# Altium project ESE516_ExampleLayoutProject_.PrjPcb (part 1 of 2)
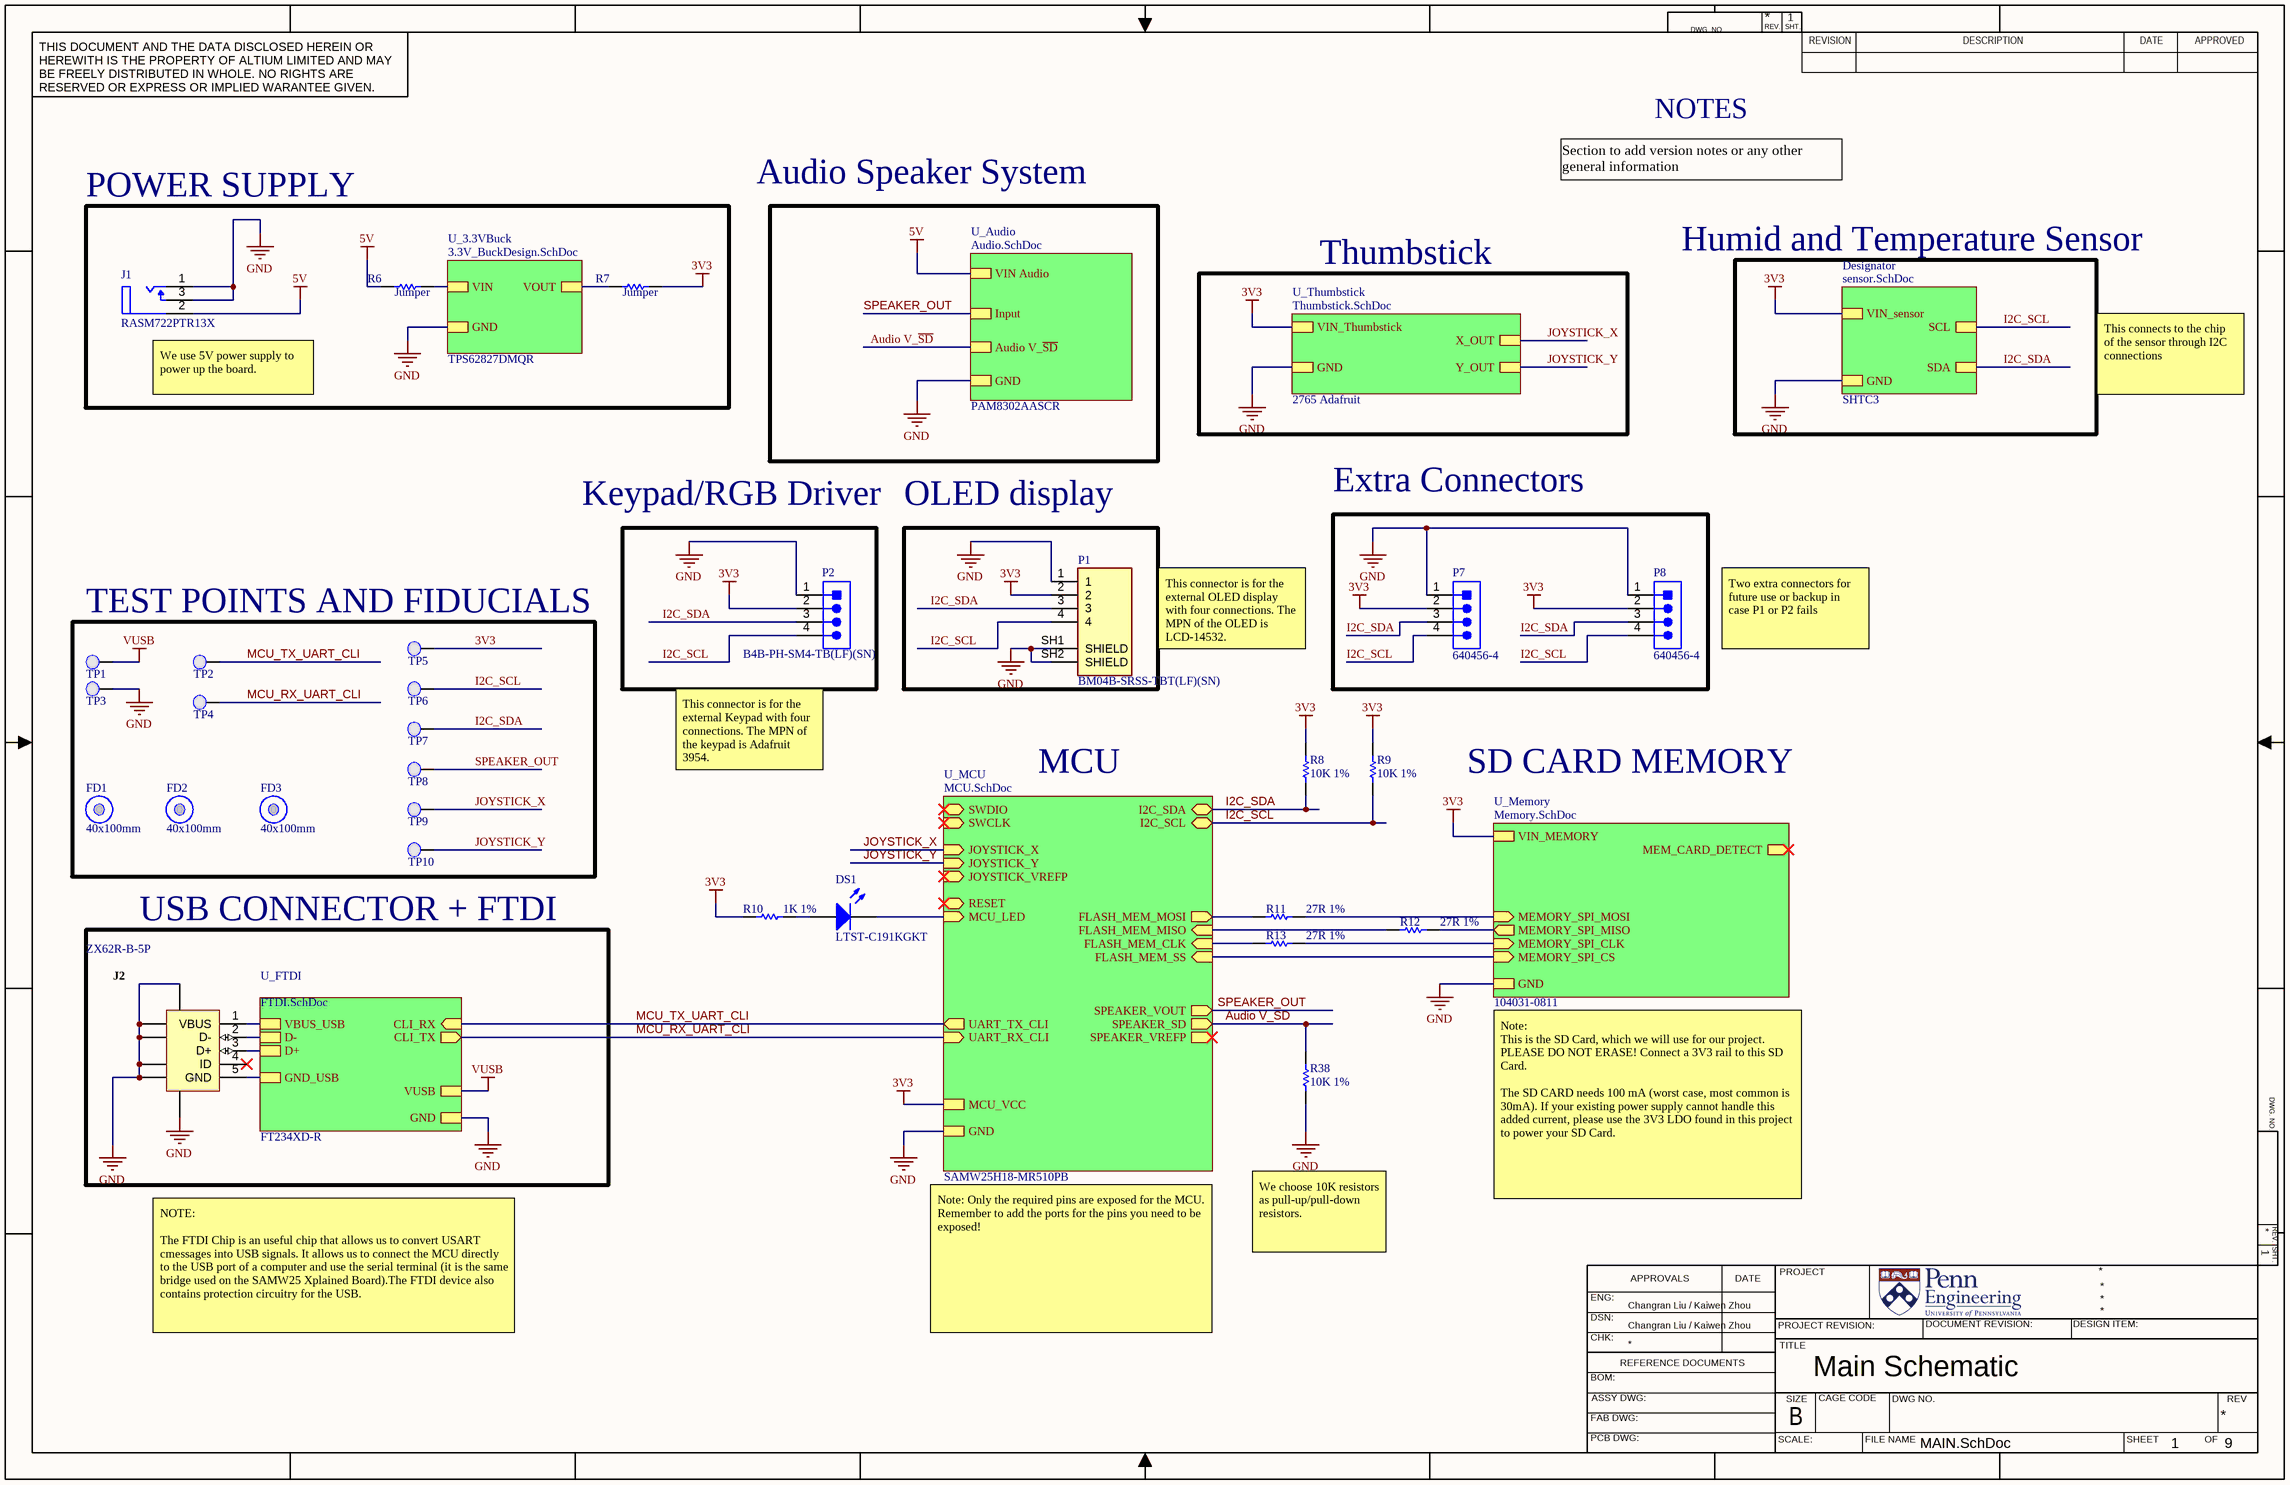
[diagram p0: MAIN.SchDoc]
8 sheets, 114 parts. Net scope: strictly hierarchical (ports join the sheet entries above them; power ports are local).
Board file: ESE516_PCB.PcbDoc
Sheets:
  MAIN.SchDoc
    U_FTDI = FTDI.SchDoc
    U_MCU = MCU.SchDoc
    U_Memory = Memory.SchDoc
    U_3.3VBuck = 3.3V_BuckDesign.SchDoc
    U_Audio = Audio.SchDoc
    U_Thumbstick = Thumbstick.SchDoc
  CommonComponents.SchDoc

## Sheet MAIN.SchDoc: Main Schematic
size 431 x 279 mm; Author: Changran Liu / Kaiwen Zhou; CompanyName: Upenn; DrawnBy: Changran Liu / Kaiwen Zhou; Engineer: Changran Liu / Kaiwen Zhou; Organization: Upenn; DocumentNumber: 1; SheetNumber: 1; SheetTotal: 9

### Parts
DS1  LTST-C191KGKT  [LITE-ON-LTST-C191KRKT-2_V]
FD1  40x100mm  [Fiducial_FT]
FD2  40x100mm  [Fiducial_FT]
FD3  40x100mm  [Fiducial_FT]
J1  RASM722PTR13X  [FP-RASM722PTR13X-MFG]
J2  ZX62R-B-5P  [HIRO-ZX62R-B-5P_V]
P1  BM04B-SRSS-TBT(LF)(SN)  [CONN_BM04B-SRSS-TBT(LF)(SN)]
P2  B4B-PH-SM4-TB(LF)(SN)  [TECO-640456-4]
P7  640456-4  [TECO-640456-4]
P8  640456-4  [TECO-640456-4]
R6  Jumper  [RESC0603(1608)_N]
R7  Jumper  [RESC0603(1608)_N]
R8  10K 1%  [RESC0603(1608)_N]
R9  10K 1%  [RESC0603(1608)_N]
R10  1K 1%  [RESC0603(1608)_N]
R11  27R 1%  [RESC0603(1608)_N]
R12  27R 1%  [RESC0603(1608)_N]
R13  27R 1%  [RESC0603(1608)_N]
R38  10K 1%  [RESC0603(1608)_N]
TP1  0.1" Pad  [PCBComponent]  (value not drawn)
TP2  0.1" Pad  [PCBComponent]  (value not drawn)
TP3  0.1" Pad  [PCBComponent]  (value not drawn)
TP4  0.1" Pad  [PCBComponent]  (value not drawn)
TP5  0.1" Pad  [PCBComponent]  (value not drawn)
TP6  0.1" Pad  [PCBComponent]  (value not drawn)
TP7  0.1" Pad  [PCBComponent]  (value not drawn)
TP8  0.1" Pad  [PCBComponent]  (value not drawn)
TP9  0.1" Pad  [PCBComponent]  (value not drawn)
TP10  0.1" Pad  [PCBComponent]  (value not drawn)

### Blocks framed on the sheet
POWER SUPPLY: J1 R6 R7
OLED display: P1
Extra Connectors: P7 P8
TEST POINTS AND FIDUCIALS: FD1-FD3 TP1-TP10
USB CONNECTOR + FTDI: J2

### Sub-sheets
Designator = sensor.SchDoc (file not in this document): VIN_sensor, SCL, SDA, GND  | MPN: SHTC3
U_3.3VBuck = 3.3V_BuckDesign.SchDoc: VIN, GND, VOUT  | MPN: TPS62827DMQR
U_Audio = Audio.SchDoc: VIN Audio, Input, GND, Audio V_~{SD}  | MPN: PAM8302AASCR
U_FTDI = FTDI.SchDoc: CLI_RX (in), CLI_TX (out), VUSB, GND, VBUS_USB, D-, D+, GND_USB  | MPN: FT234XD-R
U_MCU = MCU.SchDoc: SWDIO (bidir), SWCLK (in), UART_TX_CLI (out), UART_RX_CLI (in), FLASH_MEM_SS (in), FLASH_MEM_CLK (in), FLASH_MEM_MISO (in), FLASH_MEM_MOSI (out), RESET (bidir), MCU_LED (in), MCU_VCC, GND, JOYSTICK_X (in), JOYSTICK_Y (in), JOYSTICK_VREFP (in), I2C_SDA (bidir), I2C_SCL (bidir), SPEAKER_VOUT (out), SPEAKER_VREFP (out), SPEAKER_SD (out)  | MPN: SAMW25H18-MR510PB
U_Memory = Memory.SchDoc: MEMORY_SPI_MOSI (in), MEMORY_SPI_MISO (out), MEMORY_SPI_CLK (in), MEMORY_SPI_CS (in), MEM_CARD_DETECT (out), VIN_MEMORY, GND  | MPN: 104031-0811
U_Thumbstick = Thumbstick.SchDoc: VIN_Thumbstick, GND, X_OUT, Y_OUT  | MPN: 2765 Adafruit

### Nets
3V3: P1.2 P2.2 P7.2 P8.2 R7.2 R8.2 R9.2 R10.1 TP5.1(PAD) ; sheet U_MCU/MCU_VCC, sheet U_Memory/VIN_MEMORY, sheet U_Thumbstick/VIN_Thumbstick, sheet Designator/VIN_sensor
5V: J1.2(SLEEVE_TERMINAL) R6.1 ; sheet U_Audio/VIN Audio
GND: J1.1(TIP_TERMINAL(CENTER_PIN)) J1.3(SHUNT_TERMINAL) J2.5(GND) J2.6(SHLD) J2.7(SHLD) J2.8(SHLD) J2.9(SHLD) J2.10(SHLD) J2.11(SHLD) P1.1 P1.SH1(SHIELD) P1.SH2(SHIELD) P2.1 P7.1 P8.1 R38.1 TP3.1(PAD) ; sheet U_FTDI/GND, sheet U_FTDI/GND_USB, sheet U_MCU/GND, sheet U_Memory/GND, sheet U_3.3VBuck/GND, sheet U_Audio/GND, sheet U_Thumbstick/GND, sheet Designator/GND
VBUS: J2.1(VBUS) ; sheet U_FTDI/VBUS_USB
VIN: R6.2 ; sheet U_3.3VBuck/VIN
VUSB: TP1.1(PAD) ; sheet U_FTDI/VUSB
Audio V_~{SD}: R38.2 ; sheet U_MCU/SPEAKER_SD, sheet U_Audio/Audio V_~{SD}
FLASH_MEM_SPI_SS: sheet U_MCU/FLASH_MEM_SS, sheet U_Memory/MEMORY_SPI_CS
I2C_SCL: P1.4 P2.4 P7.4 P8.4 R9.1 TP6.1(PAD) ; sheet U_MCU/I2C_SCL, sheet Designator/SCL
I2C_SDA: P1.3 P2.3 P7.3 P8.3 R8.1 TP7.1(PAD) ; sheet U_MCU/I2C_SDA, sheet Designator/SDA
JOYSTICK_X: TP9.1(PAD) ; sheet U_MCU/JOYSTICK_X, sheet U_Thumbstick/X_OUT
JOYSTICK_Y: TP10.1(PAD) ; sheet U_MCU/JOYSTICK_Y, sheet U_Thumbstick/Y_OUT
MCU_LED: DS1.2(K) ; sheet U_MCU/MCU_LED
MCU_RX_UART_CLI: TP4.1(PAD) ; sheet U_FTDI/CLI_TX, sheet U_MCU/UART_RX_CLI
MCU_TX_UART_CLI: TP2.1(PAD) ; sheet U_FTDI/CLI_RX, sheet U_MCU/UART_TX_CLI
MEM_SPI_CLK: R13.2 ; sheet U_Memory/MEMORY_SPI_CLK
MEM_SPI_MISO: R12.2 ; sheet U_Memory/MEMORY_SPI_MISO
MEM_SPI_MOSI: R11.2 ; sheet U_Memory/MEMORY_SPI_MOSI
SERCOM1_PAD2_SPI_MISO: R12.1 ; sheet U_MCU/FLASH_MEM_MISO
SERCOM1_PAD2_SPI_MOSI: R11.1 ; sheet U_MCU/FLASH_MEM_MOSI
SERCOM1_PAD3_SPI_SCK: R13.1 ; sheet U_MCU/FLASH_MEM_CLK
SPEAKER_OUT: TP8.1(PAD) ; sheet U_MCU/SPEAKER_VOUT, sheet U_Audio/Input
USB_DATA_N: J2.2(D-) ; sheet U_FTDI/D-
USB_DATA_P: J2.3(D+) ; sheet U_FTDI/D+
VOUT: R7.1 ; sheet U_3.3VBuck/VOUT
NetDS1_1: DS1.1(A) R10.2

Not connected (* = marked no-connect by the designer): J2 4(ID)*

### Notes on the sheet
- NOTES
- Audio Speaker System
- Section to add version notes or any other general information
- Thumbstick
- Humid and Temperature Sensor
- (near J1) We use 5V power supply to power up the board.
- This connects to the chip of the sensor through I2C connections
- Keypad/RGB Driver
- This connector is for the external OLED display with four connections. The MPN of the OLED is LCD-14532.
- Two extra connectors for future use or backup in case P1 or P2 fails
- This connector is for the external Keypad with four connections. The MPN of the keypad is Adafruit 3954.
- MCU
- SD CARD MEMORY
- Note:
  This is the SD Card, which we will use for our project. PLEASE DO NOT ERASE! Connect a 3V3 rail to this SD Card.
  The SD CARD needs 100 mA (worst case, most common is 30mA). If your existing power supply cannot handle this added current, please use the 3V3 LDO found in this project to power your SD Card.
- We choose 10K resistors as pull-up/pull-down resistors.
- NOTE:
  The FTDI Chip is an useful chip that allows us to convert USART cmessages into USB signals. It allows us to connect the MCU directly to the USB port of a computer and use the serial terminal (it is the same bridge used on the SAMW25 Xplained Board).The FTDI device also contains protection circuitry for the USB.
- Note: Only the required pins are exposed for the MCU. Remember to add the ports for the pins you need to be exposed!
- DWG. NO.
- REV.
- SHT.
- THIS DOCUMENT AND THE DATA DISCLOSED HEREIN OR HEREWITH IS THE PROPERTY OF ALTIUM LIMITED AND MAY BE FREELY DISTRIBUTED IN WHOLE. NO RIGHTS ARE RESERVED OR EXPRESS OR IMPLIED WARANTEE GIVEN.
- REVISION
- DESCRIPTION
- DATE
- APPROVED
- ENG:
- APPROVALS
- PROJECT
- DSN:
- CHK:
- REFERENCE DOCUMENTS
- PROJECT REVISION:
- TITLE
- DOCUMENT REVISION:
- DESIGN ITEM:
- BOM:
- FAB DWG:
- PCB DWG:
- ASSY DWG:
- SCALE:
- SIZE
- B
- CAGE CODE
- FILE NAME
- DWG NO.
- SHEET
- OF
- REV

### Library data of the parts
DS1 = CMP-2000-05198-1: Chip LED, Green, 574 nm, 40 pF, -55 to 85 degC, 2-Pin SMD, RoHS, Tape and Reel; Manufacturer: Lite-On; Rad Hardened: No; Emitting Color: YellowGreen; Product Height (mm): 0.55mm; Forward Voltage: 2.4V; Number of Elements: 1; Dominant Wave Length: 571nm; DELETED: Compliant; Viewing Angle: 130deg; High Brightness: Yes; Peak Wavelength: 574nm; Type: Uni-Color; Forward Current: 30mA; Product Length (mm): 1.6mm; Luminous Intensity: 35mcd; Test Current (It): 20mA; Chip Material: AlGaInP; Product Depth (mm): 0.8mm; Shape Type: Rectangular; Reverse Voltage: 5V; Power Dissipation: 75W; Pin Count: 2; Lens Dimensions: 1.1X0.8X0.37mm; Packaging: TapeandReel; Main Category: ChipLED; Operating Temperature Classification: Industrial; Package Type: ChipLed; Mounting: SurfaceMount; Lum Intensity: 35mcd; Operating Temp Range: -55Cto85C; Datasheet Version: Jan-07; Datasheet URL: http://download.siliconexpert.com/pdfs/2007/08/26/semi_b/manual/lot/ds/ltst-c191kgkt.pdf; Manufacturer URL: http://www.us.liteon.com/
FD1-FD3 = CMP-00174-A.4: Fiducial 40x100mm
J1 = CMP-47995-000002-1: CONN PWR JACK 2.1X5.5MM SOLDER; Manufacturer: Switchcraft; Shielding: Unshielded; Gender: Male; Current Rating: 5A; Termination: Solder; Contact Material: Copper Alloy; Package Quantity: 120; Case/Package: SMD/SMT; Contact Plating: Tin; Connector Type: Jack; Housing Material: Thermoplastic; Mount: Surface Mount; Housing Color: Black; Color: Black; Supplier 1: Digi-Key; Supplier Part Number 1: SC2028-1-ND; RoHS: Yes; Category: Power Connectors; Stock 1: 5317; Pricing 1: 1=2.04000, 10=1.95800, 25=1.79520, 50=1.71360 (USD); ComponentLink1URL: https://datasheet.ciiva.com/17/edg4-17820.pdf?src-supplier=Digi-Key; ComponentLink1Description: https://datasheet.ciiva.com/17/edg4-17820.pdf?src-supplier=Digi-Key; ComponentLink2URL: https://datasheet.ciiva.com/18496/edg4-18496955.pdf?src-supplier=Digi-Key; ComponentLink2Description: https://datasheet.ciiva.com/18496/edg4-18496955.pdf?src-supplier=Digi-Key; ComponentLink3URL: https://datasheet.ciiva.com/18496/edg4-18496956.pdf?src-supplier=Digi-Key; ComponentLink3Description: https://datasheet.ciiva.com/18496/edg4-18496956.pdf?src-supplier=Digi-Key; ComponentLink4URL: https://datasheet.ciiva.com/18496/edg4-18496957.pdf?src-supplier=Digi-Key; ComponentLink4Description: https://datasheet.ciiva.com/18496/edg4-18496957.pdf?src-supplier=Digi-Key; Manufacturer Part Number: RASM722PTR13X
J2 = CMP-0031-00001-1: Connector; USBMicro-B,Reverse type, SMT; 5 Position; Right Angle; DatasheetVersion: 08/2010; Operating Temperature: -30 to 85 degC; Mounting Technology: Surface Mount; PartNumber: ZX62R-B-5P; PackageReference: ZX62R-B-5P; ComponentLink2URL: http://www.hirose.co.jp/cataloge_hp/e24200011.pdf; ComponentLink1URL: http://www.hirose.com/â€Ž; ComponentLink2Description: Datasheet; PackageDescription: 5-Pin USB Micro-B R/A Connector; ComponentLink1Description: Manufacturer URL
P1 = BM04B-SRSS-TBT(LF)(SN): Connector Header Surface Mount 4 position 0.039 _1.00mm_; MF: JST Sales; MP: BM04B-SRSS-TBT_LF__SN_; Price: None; Availability: Unavailable; SnapEDA_Link: https://www.snapeda.com/parts/BM04B-SRSS-TBT%28LF%29%28SN%29/JST%20Sales%20America%20Inc./view-part/1647403/?ref=snap; Value: *; Package: None
P2 = B4B-PH-SM4-TB(LF)(SN): Manufacturer: JST; Connector Type: Male Pin; Contact Resistance: 20mR; Current Rating: 2A; Voltage Rating (AC): 100V; Number of Poles: 4; Gender: Male; Insulation Resistance: 1GR; Pitch: 2mm; Supplier 1: Digi-Key; Supplier Part Number 1: 455-1736-1-ND; Manufacturer Part Number: B4B-PH-SM4-TB(LF)(SN); RoHS: Yes; Category: Connectors; Mount: Surface Mount; Housing Material: Polyamide; Contact Plating: Tin,Copper; Contact Material: Copper Alloy,Bronze,Tin,Brass; Color: Natural,White; Housing Color: Beige; Min Operating Temperature: -25°C; Max Operating Temperature: 85°C; Number of Rows: 1; Voltage Rating: 100V; Max Current Rating: 2A; Packaging: Tape and Reel; Number of Positions: 4; Termination: Solder; Fastening Type: Detent; Number of Contacts: 4; Max Voltage Rating (AC): 100V; Working Voltage: 100V; Orientation: Straight; Length: 11.95mm; Width: 5.5mm; Height: 9.4mm; Lead Pitch: 2mm; Contact Mating Length: 0.13inch; Depth: 5mm; Lead Free: Lead Free; Flammability Rating: UL94 V-0; REACH SVHC: No SVHC; ComponentLink1URL: https://datasheet.ciiva.com/8052/1699381-8052048.pdf?src-supplier=Element14; ComponentLink1Description: https://datasheet.ciiva.com/8052/1699381-8052048.pdf?src-supplier=Element14; ComponentLink2URL: https://datasheet.ciiva.com/11747/0900766b80ddea81-11747504.pdf?src-supplier=RSComponents; ComponentLink2Description: https://datasheet.ciiva.com/11747/0900766b80ddea81-11747504.pdf?src-supplier=RSComponents; ComponentLink3URL: https://datasheet.ciiva.com/6747/80567-6747409.pdf?src-supplier=Newark; ComponentLink3Description: https://datasheet.ciiva.com/6747/80567-6747409.pdf?src-supplier=Newark; ComponentLink4URL: https://datasheet.ciiva.com/727/eph-727525.pdf?src-supplier=Digi-Key; ComponentLink4Description: https://datasheet.ciiva.com/727/eph-727525.pdf?src-supplier=Digi-Key; ComponentLink5URL: https://datasheet.ciiva.com/712/eph-712582.pdf?src-supplier=Digi-Key; ComponentLink5Description: https://datasheet.ciiva.com/712/eph-712582.pdf?src-supplier=Digi-Key; ComponentLink6URL: https://datasheet.ciiva.com/712/eph-712583.pdf?src-supplier=Digi-Key; ComponentLink6Description: https://datasheet.ciiva.com/712/eph-712583.pdf?src-supplier=Digi-Key
P7 P8 = CMP-2000-05419-1: Male Header, Pitch 2.54 mm, 1 x 4 Position, Height 10.03 mm, Tail Length 3.56 mm, RoHS, Bulk; Manufacturer: TE Connectivity; Material, Housing: Polyester; Primary Type: InterconnectSystem; Mount Angle: Vertical; Color, Housing: White; Current, Rating: 5 / A; Agency Approvals: CSA,UL; Contact Termination Area Plating: Tin; Temperature, Operating: -55to+105 / degC; Standards: RoHSCompliant,ELVCompliant,UL94V-0; Number of Positions: 4; Brand/Series: MTA-100Series; Angle: Straight; Pin Spacing: 0.1 / "; Material, Contact: CopperAlloy; Connector Type: MTA-100; Special Features: Pinstrip; Mounting Hole Size: 0.04 / "; Contact Centerline Spacing: 0.100 / in.; Voltage, Rating: 250 / V; Manufacturer URL: http://www.te.com/; Length, Pin: 0.14 / "; Length, Overall: 0.4 / "; Color: White; Flammability Rating: UL94V-0; Mounting Type: PCMount; Termination: Solder; Datasheet URL: https://datasheet.ciiva.com/16286/eng-ds-82056-mta-0608-16286228.pdf; Number of Contacts: 4; Contact Shape: Square; Contact Mating Area Plating: Tin; Length, Terminal Post: 0.14 / in.; Size, Post: 0.025 / in.; Contact Plating: Tin; Type: PCBPlug; Datasheet Version: Dec-14; Number of Rows: 1
R6 R7 = CMP-1012-00001-1: Jumper 0603 (1608 Metric); Case-Metric: 1608; Value: 0.00 Ohm; Power: None; Case-EIA: 0603; Technology: SMT; Tolerance: None
R8 R9 R38 = CMP-1012-00623-1: 10K 0.1W 1% 0603 (1608 Metric)  SMD; Value: 10000.00 Ohm; Case-EIA: 0603; Case-Metric: 1608; Power: 0.1 W; Tolerance: 1 %; Technology: SMT
R10 = CMP-1012-00510-1: 1K 0.1W 1% 0603 (1608 Metric)  SMD; Case-Metric: 1608; Case-EIA: 0603; Value: 1000.00 Ohm; Technology: SMT; Tolerance: 1 %; Power: 0.1 W
R11-R13 = CMP-1012-00331-1: 27R 0.1W 1% 0603 (1608 Metric)  SMD; Case-EIA: 0603; Value: 27.00 Ohm; Case-Metric: 1608; Technology: SMT; Tolerance: 1 %; Power: 0.1 W
TP1-TP10 = 0.1" Pad-A.4

## Sheet FTDI.SchDoc: FTDI
size 431 x 279 mm; Author: Changran Liu / Kaiwen Zhou; CompanyName: Upenn; DrawnBy: Changran Liu / Kaiwen Zhou; Engineer: Changran Liu / Kaiwen Zhou; Organization: Upenn; DocumentNumber: 4; SheetNumber: 4; SheetTotal: 9
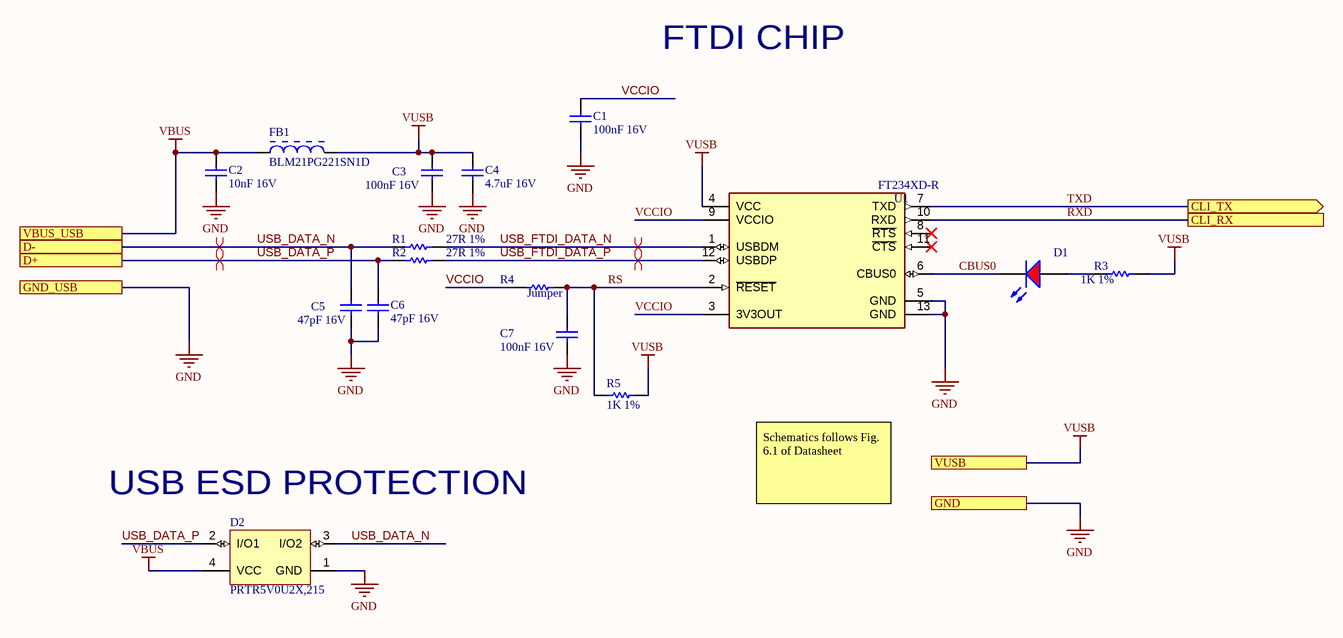
[diagram p1: FTDI.SchDoc]

### Parts
C1  100nF 16V  [CAPC0603(1608)100_N]
C2  10nF 16V  [CAPC0603(1608)100_N]
C3  100nF 16V  [CAPC0603(1608)100_N]
C4  4.7uF 16V  [CAPC0805(2012)145_N]
C5  47pF 16V  [CAPC0603(1608)100_N]
C6  47pF 16V  [CAPC0603(1608)100_N]
C7  100nF 16V  [CAPC0603(1608)100_N]
D1  LTST-C170CKT  [LTST-C170CKT_V]  (value not drawn)
D2  PRTR5V0U2X,215  [NXP-SOT143B-4_V]
FB1  BLM21PG221SN1D  [MURA-BLM21-B20-CHIP-2_V2]
R1  27R 1%  [RESC0603(1608)_N]
R2  27R 1%  [RESC0603(1608)_N]
R3  1K 1%  [RESC0603(1608)_N]
R4  Jumper  [RESC0603(1608)_N]
R5  1K 1%  [RESC0603(1608)_N]
U1  FT234XD-R  [FP-DFN-12-IPC_B]

### Ports
CLI_RX, CLI_TX (out), D+, D-, GND, GND_USB, VBUS_USB, VUSB

### Nets
GND: C1.1 C2.1 C3.1 C4.1 C5.1 C6.1 C7.1 D2.1(GND) U1.5(GND) U1.13(GND) ; port GND, port GND_USB
VBUS: C2.2 D2.4(VCC) FB1.1 ; port VBUS_USB
VUSB: C3.2 C4.2 FB1.2 R3.2 R5.1 U1.4(VCC) ; port VUSB
CBUS0: D1.2(K) U1.6(CBUS0)  [project net CBUS0_4]
RS: C7.2 R4.2 R5.2 U1.2(~{RESET})  [project net RS_4]
RXD: U1.10(RXD) ; port CLI_RX  [project net MCU_TX_UART_CLI]
TXD: U1.7(TXD) ; port CLI_TX  [project net MCU_RX_UART_CLI]
USB_DATA_N: C5.2 D2.3(I/O2) R1.1 ; port D-
USB_DATA_P: C6.2 D2.2(I/O1) R2.1 ; port D+
USB_FTDI_DATA_N: R1.2 U1.1(USBDM)  [project net USB_FTDI_DATA_N_4]
USB_FTDI_DATA_P: R2.2 U1.12(USBDP)  [project net USB_FTDI_DATA_P_4]
VCCIO: C1.2 R4.1 U1.3(3V3OUT) U1.9(VCCIO)  [project net VCCIO_4]
NetD1_1: D1.1(A) R3.1

Not connected (* = marked no-connect by the designer): U1 8(~{RTS})* 11(~{CTS})*

### Layout directives
differential pair: USB_DATA_N, USB_DATA_P, USB_FTDI_DATA_N_4, USB_FTDI_DATA_P_4

### Notes on the sheet
- FTDI CHIP
- (near D2) USB ESD PROTECTION
- Schematics follows Fig. 6.1 of Datasheet
- DWG. NO.
- REV.
- SHT.
- THIS DOCUMENT AND THE DATA DISCLOSED HEREIN OR HEREWITH IS THE PROPERTY OF ALTIUM LIMITED AND MAY BE FREELY DISTRIBUTED IN WHOLE. NO RIGHTS ARE RESERVED OR EXPRESS OR IMPLIED WARANTEE GIVEN.
- REVISION
- DESCRIPTION
- DATE
- APPROVED
- ENG:
- APPROVALS
- PROJECT
- DSN:
- CHK:
- REFERENCE DOCUMENTS
- PROJECT REVISION:
- TITLE
- DOCUMENT REVISION:
- DESIGN ITEM:
- BOM:
- FAB DWG:
- PCB DWG:
- ASSY DWG:
- SCALE:
- SIZE
- B
- CAGE CODE
- FILE NAME
- DWG NO.
- SHEET
- OF
- REV

### Library data of the parts
C1 C3 C7 = CMP-1035-02584-1: CAP 100nF 16V ±10% 0603 (1608 Metric) Thickness 1mm SMD; Tolerance: Â±10%; Case-EIA: 0603; Case-Metric: 1608; Technology: SMT; Max Thickness: 1 mm; Value: 100nF; Rated Voltage: 16 V
C2 = CMP-1035-02311-1: CAP 10nF 16V ±10% 0603 (1608 Metric) Thickness 1mm SMD; Case-EIA: 0603; Case-Metric: 1608; Tolerance: Â±10%; Rated Voltage: 16 V; Value: 10nF; Max Thickness: 1 mm; Technology: SMT
C4 = CMP-1036-04893-1: CAP 4.7uF 16V -20% to +80% 0805 (2012 Metric) Thickness 1.45mm SMD; Case-Metric: 2012; Case-EIA: 0805; Max Thickness: 1.45 mm; Value: 4.7uF; Rated Voltage: 16 V; Tolerance: -20% to +80%; Technology: SMT
C5 C6 = CMP-1035-01048-1: CAP 47pF 16V ±0.5pF 0603 (1608 Metric) Thickness 1mm SMD; Case-EIA: 0603; Case-Metric: 1608; Tolerance: Â±0.5pF; Technology: SMT; Value: 47pF; Rated Voltage: 16 V; Max Thickness: 1 mm
D1 = CMP-1674-00001-5: LED Uni-Color Red, 100 mW, 200 mA, -55 to 85 degC, 2-Pin SMD, RoHS, Tape and Reel; Manufacturer: Lite-On; PackageReference: C170CKT; ComponentLink1Description: Manufacturer URL; ComponentLink1URL: http://www.us.liteon.com/; Package Quantity: 3000; Packaging: Tape and Reel; Pins: 2; ComponentLink2URL: http://media.digikey.com/pdf/Data%20Sheets/Lite-On%20PDFs/LTST-C170CKT.pdf; Max Operating Temperature: 85 degC; Min Operating Temperature: -55 degC; Mounting Technology: Surface Mount; Mount: Surface Mount; Length: 2 mm; ComponentLink2Description: Datasheet; DatasheetVersion: 03/2003; Height: 1.1 mm; PackageDescription: 2-Pin Surface Mount Device, Body 2 x 1.25 mm; RoHSCompliant: true; Colour: Red
D2 = CMP-2000-05285-1: Ultra Low Capacitance Double Rail-to-Rail ESD Protection Diode, 5.5 V, 1 pF, -40 to 85 degC, 4-Pin SOT143B, RoHS, Tape and Reel; Manufacturer: NXP Semiconductors; Capacitance Value: 16pF; Number of Elements: 1; Rad Hardened: No; Reverse Breakdown Voltage: 6V; Working Voltage (Max): 5.5V; Polarity: Uni-Directional; Configuration: Quad; Leakage Current: 0.1uA; Product Height (mm): 1mm; Suppressor Type: DiodeArrays; Product Length (mm): 3mm; Product Depth (mm): 1.4mm; ESD Protection Voltage: 8KV@ContactDisc; Package Type: SOT; Mounting: SurfaceMount; Packaging: TapeandReel; Datasheet Version: Rev. 02, 01/2008; Reverse Stand-off Voltage: 5.5V; Manufacturer URL: http://www.nxp.com/; Operating Temp Range: -40Cto85C; Operating Temperature Classification: Industrial; Working Voltage: 5.5V; Operating Temperature Min Deg. C: -40C; Datasheet URL: https://datasheet.ciiva.com/4479/prtr5v0u2x-102853-4479461.pdf; Leakage Current (Max): 0.1uA; Direction Type: Uni-Directional; Pin Count: 3+Tab; Operating Temperature Max Deg. C: 85C; Mounting Style: SurfaceMount; Package / Case: SOT
FB1 = CMP-0686-00610-2: Chip Ferrite Bead for Power Lines, 220 Ohm, 2000 mA, -55 to 125 degC, 2 x 1.25 x 1.05 mm SMD, Tape and Reel; Manufacturer: Murata; DC Resistance: 0.045 Ohm Max.; Impedance (at 100 MHz): 220 Ohm +/- 25%; Rated Current: 2000 mA; PartNumber: BLM21PG221SN1D; Mounting Technology: Surface Mount; DatasheetVersion: 08/2013; ComponentLink3URL: http://www.murata.com/products/catalog/pdf/c31e.pdf; ComponentLink1URL: http://www.murata.com/; ComponentLink1Description: Manufacturer URL; ComponentLink2URL: http://www.murata.com/products/catalog/pdf/c31e.pdf; PackageDescription: 2-Pin Chip, Body 2 x 1.25 mm; ComponentLink3Description: Package Specification; Operating Temperature Range: -55 to 125 degC; Packing: Tape and Reel; ComponentLink2Description: Datasheet; PackageReference: BLM21_H1050-2
R1 R2 = CMP-1012-00331-1: as R11 on sheet MAIN; Technology: SMT; Tolerance: 1 %; Power: 0.1 W
R3 R5 = CMP-1012-00510-1: as R10 on sheet MAIN; Technology: SMT; Tolerance: 1 %; Power: 0.1 W
R4 = CMP-1012-00001-1: as R6 on sheet MAIN; Technology: SMT; Tolerance: None
U1 = CMP-0248-00027-3: IC USB SERIAL BASIC UART 12DFN; Min Supply Voltage: 2.97V; Number of Ports: 1; Operating Supply Voltage: 5V; Operating Supply Current: 8mA; Max Supply Voltage: 5.5V; Data Rate: 3Mbps; Length: 3mm; Case/Package: DFN; Mount: Surface Mount; Packaging: Tape and Reel; Max Operating Temperature: 85°C; Height: 0.75mm; Number of Pins: 12; Number of Transceivers: 1; Package Quantity: 5000; Min Operating Temperature: -40°C; Width: 3mm; REACH SVHC: No SVHC; Interface: UART; Lead Free: Lead Free

## Sheet MCU.SchDoc: MCU
size 431 x 279 mm; Author: Changran Liu / Kaiwen Zhou; CompanyName: Upenn; DrawnBy: Changran Liu / Kaiwen Zhou; Engineer: Changran Liu / Kaiwen Zhou; Organization: Upenn; DocumentNumber: 3; SheetNumber: 3; SheetTotal: 9
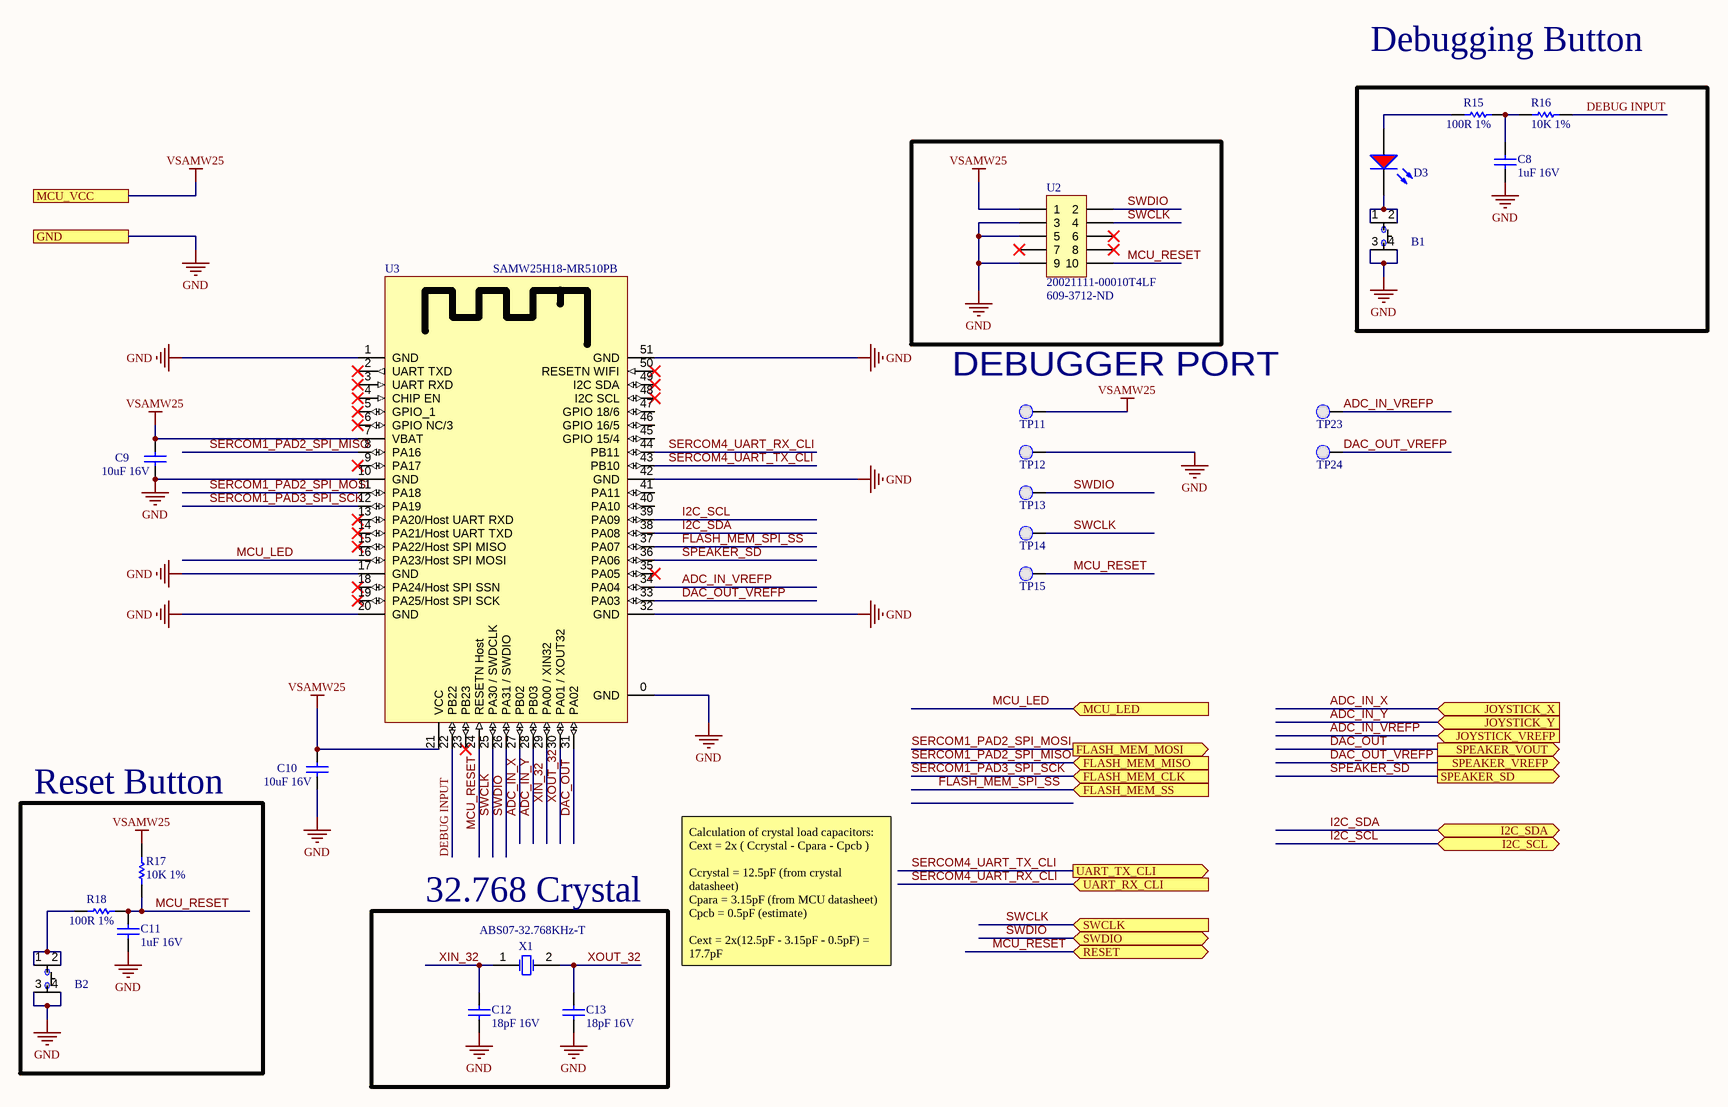
[diagram p2: MCU.SchDoc]

### Parts
B1  PTS810 SJK 250 SMTR LFS  [PTS810 SJK 250 SMTR LFS]  (value not drawn)
B2  PTS810 SJK 250 SMTR LFS  [PTS810 SJK 250 SMTR LFS]  (value not drawn)
C8  1uF 16V  [CAPC0603(1608)100_N]
C9  10uF 16V  [CAPC0805(2012)145_L]
C10  10uF 16V  [CAPC0805(2012)145_L]
C11  1uF 16V  [CAPC0603(1608)100_N]
C12  18pF 16V  [CAPC0603(1608)100_N]
C13  18pF 16V  [CAPC0603(1608)100_N]
D3  LTST-C170CKT  [LTST-C170CKT_V]  (value not drawn)
R15  100R 1%  [RESC0603(1608)_N]
R16  10K 1%  [RESC0603(1608)_N]
R17  10K 1%  [RESC0603(1608)_N]
R18  100R 1%  [RESC0603(1608)_N]
TP11  0.1" Pad  [PCBComponent]  (value not drawn)
TP12  0.1" Pad  [PCBComponent]  (value not drawn)
TP13  0.1" Pad  [PCBComponent]  (value not drawn)
TP14  0.1" Pad  [PCBComponent]  (value not drawn)
TP15  0.1" Pad  [PCBComponent]  (value not drawn)
TP23  0.1" Pad  [PCBComponent]  (value not drawn)
TP24  0.1" Pad  [PCBComponent]  (value not drawn)
U2  20021111-00010T4LF  Supplier Part Number 1: 609-3712-ND  [20021111-00010T4LF]
U3  SAMW25H18-MR510PB  [SAMW25H18-MR510PB]
X1  ABS07-32.768KHz-T  [ABRA-ABS07-2_V]

### Blocks framed on the sheet
Reset Button: B2 C11 R17 R18
32.768 Crystal: C12 C13 X1

### Ports
FLASH_MEM_CLK (in), FLASH_MEM_MISO (in), FLASH_MEM_MOSI (out), FLASH_MEM_SS (in), GND, I2C_SCL (bidir), I2C_SDA (bidir), JOYSTICK_VREFP (in), JOYSTICK_X (in), JOYSTICK_Y (in), MCU_LED (in), MCU_VCC, RESET (bidir), SPEAKER_SD (out), SPEAKER_VOUT (out), SPEAKER_VREFP (out), SWCLK (in), SWDIO (bidir), UART_RX_CLI (in), UART_TX_CLI (out)

### Nets
GND: B1.3 B1.4 B2.3 B2.4 C8.1 C9.1 C10.1 C11.1 C12.1 C13.1 TP12.1(PAD) U2.3 U2.5 U2.9 U3.0(GND) U3.1(GND) U3.10(GND) U3.17(GND) U3.20(GND) U3.32(GND) U3.42(GND) U3.51(GND) ; port GND
VSAMW25: C9.2 C10.2 R17.2 TP11.1(PAD) U2.1 U3.7(VBAT) U3.21(VCC) ; port MCU_VCC  [project net 3V3]
ADC_IN_VREFP: TP23.1(PAD) U3.34(PA04) ; port JOYSTICK_VREFP
ADC_IN_X: U3.27(PB02) ; port JOYSTICK_X  [project net JOYSTICK_X]
ADC_IN_Y: U3.28(PB03) ; port JOYSTICK_Y  [project net JOYSTICK_Y]
DAC_OUT: U3.31(PA02) ; port SPEAKER_VOUT  [project net SPEAKER_OUT]
DAC_OUT_VREFP: TP24.1(PAD) U3.33(PA03) ; port SPEAKER_VREFP
DEBUG INPUT: R16.1 U3.22(PB22)  [project net DEBUG INPUT_3]
FLASH_MEM_SPI_SS: U3.37(PA07) ; port FLASH_MEM_SS
I2C_SCL: U3.39(PA09) ; port I2C_SCL
I2C_SDA: U3.38(PA08) ; port I2C_SDA
MCU_LED: U3.16(PA23/Host_SPI_MOSI) ; port MCU_LED
MCU_RESET: C11.2 R17.1 R18.2 TP15.1(PAD) U2.10 U3.24(RESETN_Host) ; port RESET
SERCOM1_PAD2_SPI_MISO: U3.8(PA16) ; port FLASH_MEM_MISO
SERCOM1_PAD2_SPI_MOSI: U3.11(PA18) ; port FLASH_MEM_MOSI
SERCOM1_PAD3_SPI_SCK: U3.12(PA19) ; port FLASH_MEM_CLK
SERCOM4_UART_RX_CLI: U3.44(PB11) ; port UART_RX_CLI  [project net MCU_RX_UART_CLI]
SERCOM4_UART_TX_CLI: U3.43(PB10) ; port UART_TX_CLI  [project net MCU_TX_UART_CLI]
SPEAKER_SD: U3.36(PA06) ; port SPEAKER_SD  [project net Audio V_~{SD}]
SWCLK: TP14.1(PAD) U2.4 U3.25(PA30_/_SWDCLK) ; port SWCLK
SWDIO: TP13.1(PAD) U2.2 U3.26(PA31_/_SWDIO) ; port SWDIO
XIN_32: C12.2 U3.29(PA00_/_XIN32) X1.1(X1)  [project net XIN_32_3]
XOUT_32: C13.2 U3.30(PA01_/_XOUT32) X1.2(X2)  [project net XOUT_32_3]
NetB1_1: B1.1 B1.2 D3.2(K)
NetB2_1: B2.1 B2.2 R18.1
NetC8_2: C8.2 R15.2 R16.2
NetD3_1: D3.1(A) R15.1

Not connected (* = marked no-connect by the designer): U2 6* 7* 8*; U3 2(UART_TXD)* 3(UART_RXD)* 4(CHIP_EN)* 5(GPIO_1)* 6(GPIO_NC/3)* 9(PA17)* 13(PA20/Host_UART_RXD)* 14(PA21/Host_UART_TXD)* 15(PA22/Host_SPI_MISO)* 18(PA24/Host_SPI_SSN)* 19(PA25/Host_SPI_SCK)* 23(PB23)* 35(PA05)* 40(PA10) 41(PA11) 45(GPIO_15/4) 46(GPIO_16/5) 47(GPIO_18/6) 48(I2C_SCL)* 49(I2C_SDA)* 50(RESETN_WIFI)*

### Notes on the sheet
- Debugging Button
- (near TP11) DEBUGGER PORT
- Calculation of crystal load capacitors:
  Cext = 2x ( Ccrystal - Cpara - Cpcb )
  Ccrystal = 12.5pF (from crystal datasheet)
  Cpara = 3.15pF (from MCU datasheet)
  Cpcb = 0.5pF (estimate)
  Cext = 2x(12.5pF - 3.15pF - 0.5pF) = 17.7pF
- DWG. NO.
- REV.
- SHT.
- THIS DOCUMENT AND THE DATA DISCLOSED HEREIN OR HEREWITH IS THE PROPERTY OF ALTIUM LIMITED AND MAY BE FREELY DISTRIBUTED IN WHOLE. NO RIGHTS ARE RESERVED OR EXPRESS OR IMPLIED WARANTEE GIVEN.
- REVISION
- DESCRIPTION
- DATE
- APPROVED
- ENG:
- APPROVALS
- PROJECT
- DSN:
- CHK:
- REFERENCE DOCUMENTS
- PROJECT REVISION:
- TITLE
- DOCUMENT REVISION:
- DESIGN ITEM:
- BOM:
- FAB DWG:
- PCB DWG:
- ASSY DWG:
- SCALE:
- SIZE
- B
- CAGE CODE
- FILE NAME
- DWG NO.
- SHEET
- OF
- REV

### Library data of the parts
B1 B2 = PTS810 SJK 250 SMTR LFS: SWITCH TACTILE SPST-NO 0.05A 16V Tactile Switch SPST-NO Top Actuated Surface Mount; Manufacturer: ITT /  C&K Components; Part # Aliases: Y97LT25B5DBFP; Operating Force: 2.6 N; Actuator: Oval; Current Rating: 50 mA; Voltage Rating DC: 16 VDC; Contact Form: SPST; Switch Function: OFF - (ON); Mounting Direction: Straight; Stem Height: 2.5 mm; Brand: C&K Components; Travel: 0.15 mm; Manufacturer Part Number: PTS810SJK250SMTRLFS; Product Category: Tactile Switches; RoHS: Details; Termination Style: J Form Lead; Mounting Style: SMD/SMT; Color: White; Packaging: Reel; Contact Plating: Silver; Operating Temperature Range: - 40 C to + 85 C; Series: PTS810; Factory Pack Quantity: 2900; ComponentLink1URL: https://datasheet.ciiva.com/18514/pts810-4mar13-18514061.pdf; ComponentLink1Description: https://datasheet.ciiva.com/18514/pts810-4mar13-18514061.pdf; ComponentLink2URL: https://datasheet.ciiva.com/18514/pts810-4mar13-18514062.pdf; ComponentLink2Description: https://datasheet.ciiva.com/18514/pts810-4mar13-18514062.pdf; ComponentLink3URL: https://datasheet.ciiva.com/18514/pts810-4mar13-18514063.pdf; ComponentLink3Description: https://datasheet.ciiva.com/18514/pts810-4mar13-18514063.pdf; Supplier 1: Digi-Key; Supplier Part Number 1: CKN10503CT-ND
C8 C11 = CMP-1035-02736-1: CAP 1uF 16V ±5% 0603 (1608 Metric) Thickness 1mm SMD; Case-Metric: 1608; Case-EIA: 0603; Tolerance: Â±5%; Technology: SMT; Max Thickness: 1 mm; Rated Voltage: 16 V; Value: 1uF
C9 C10 = CMP-1036-04927-1: CAP 10uF 16V ±10% 0805 (2012 Metric) Thickness 1.45mm SMD; Case-EIA: 0805; Tolerance: Â±10%; Case-Metric: 2012; Rated Voltage: 16 V; Technology: SMT; Value: 10uF; Max Thickness: 1.45 mm
C12 C13 = CMP-1035-00738-1: CAP 18pF 16V ±5% 0603 (1608 Metric) Thickness 1mm SMD; Tolerance: Â±5%; Case-EIA: 0603; Case-Metric: 1608; Max Thickness: 1 mm; Rated Voltage: 16 V; Value: 18pF; Technology: SMT
D3 = CMP-1674-00001-5: as D1 on sheet FTDI; PackageReference: C170CKT; ComponentLink1Description: Manufacturer URL; ComponentLink1URL: http://www.us.liteon.com/; Package Quantity: 3000; Packaging: Tape and Reel; Pins: 2; ComponentLink2URL: http://media.digikey.com/pdf/Data%20Sheets/Lite-On%20PDFs/LTST-C170CKT.pdf; Max Operating Temperature: 85 degC; Min Operating Temperature: -55 degC; Mounting Technology: Surface Mount; Mount: Surface Mount; Length: 2 mm; ComponentLink2Description: Datasheet; DatasheetVersion: 03/2003; Height: 1.1 mm; PackageDescription: 2-Pin Surface Mount Device, Body 2 x 1.25 mm; RoHSCompliant: true; Colour: Red
R15 R18 = CMP-1012-00397-1: 100R 0.1W 1% 0603 (1608 Metric)  SMD; Value: 100.00 Ohm; Case-EIA: 0603; Case-Metric: 1608; Technology: SMT; Tolerance: 1 %; Power: 0.1 W
R16 R17 = CMP-1012-00623-1: as R8 on sheet MAIN; Power: 0.1 W; Tolerance: 1 %; Technology: SMT
TP11-TP15 TP23 TP24 = 0.1" Pad-A.4
U2 = 20021111-00010T4LF: CONN HEADER 10POS UNSHD VERT T/H; Manufacturer: Amphenol / FCI; Stack Height: 2.5 mm; Number of Positions / Contacts: 10; Brand: FCI; Pitch: 1.27 mm; Mounting Angle: Vertical; Current Rating: 10 A; Mating Post Length: 3.05 mm; Voltage Rating: 125 V; Manufacturer Part Number: 20021111-00010T4LF; Mounting Style: Through Hole; Product Category: Headers & Wire Housings; RoHS: Details; Series: Minitek; Product Type: Headers; Type: Unshrouded; Number of Positions: 10; Number of Rows: 2; Contact Plating: Gold; Housing Material: Plastic; Termination Style: Through Hole; Contact Material: Nickel; Packaging: Tube; Factory Pack Quantity: 93; Termination Post Length: 2.3 mm; ComponentLink1URL: https://datasheet.ciiva.com/1433/1079612-1433267.pdf; ComponentLink1Description: https://datasheet.ciiva.com/1433/1079612-1433267.pdf; ComponentLink2URL: https://datasheet.ciiva.com/409/20021111-409158.pdf; ComponentLink2Description: https://datasheet.ciiva.com/409/20021111-409158.pdf; ComponentLink3URL: https://datasheet.ciiva.com/5131/20021111-5131386.pdf; ComponentLink3Description: https://datasheet.ciiva.com/5131/20021111-5131386.pdf; ComponentLink4URL: https://datasheet.ciiva.com/9465/20021111-9465402.pdf; ComponentLink4Description: https://datasheet.ciiva.com/9465/20021111-9465402.pdf; Supplier 1: Digi-Key
U3 = SAMW25H18-MR510PB: RF TXRX MODULE WIFI TRACE ANT; Manufacturer: Atmel; Manufacturer Part Number: ATSAMW25H18-MR510PB; Protocol: 802.11b/g/n; Frequency: 2.4GHz; Data Rate: 65Mbps; Power - Output: 17dBm; Sensitivity: -95.5dBm; Serial Interfaces: SPI, UART; Antenna Type: Integrated, Trace; Memory Size: 256kB Flash, 32kB SRAM; Voltage - Supply: 2.7 V ~ 4.2 V; Category: RF/IF and RFID; Family: RF Transceiver Modules; Series: Xplained Pro; Packaging: Tray; RF Family/Standard: WiFi; Modulation: -; Current - Receiving: -; Current - Transmitting: -; Mounting Type: Surface Mount; Operating Temperature: -40°C ~ 85°C; Package / Case: Module; ComponentLink1URL: http://www.atmel.com/devices/ATSAMW25.aspx; ComponentLink1Description: http://www.atmel.com/devices/ATSAMW25.aspx; ComponentLink2URL: http://www.farnell.com/datasheets/1965115.pdf; ComponentLink2Description: http://www.farnell.com/datasheets/1965115.pdf; Supplier 1: Digikey; Stock 1: 120; Pricing 1: 1=19.14 (USD); Supplier Part Number 1: ATSAMW25H18-MR510PB-ND
X1 = CMP-0447-00001-2: Crystal, 32.768 kHz, 12.5 pF, -40 to 85 degC, SMD Low Profile 3.2 x 1.5 x 0.9 mm, Tape and Reel; Manufacturer: Abracon; Q Value (Type): 30000; Operation Mode: Flexural Mode (Tuning Fork); Shunt Capacitance (C0): 0.9 to 1.2 pF; Load Capacitance (CL): 12.5 pF; Frequency Tolerance @+25degC: +/- 20 ppm; Drive Level (Type): 0.1 uW; Equivalent Series Resistance (R1): 70 Kohm; Insulation Resistance (Min): 500 Mohm; ComponentLink3URL: http://www.abracon.com/Resonators/ABS07.pdf; PackageDescription: 2-Pin Hand Drawn, Body 3.2x1.5mm, Pitch 2.5mm; Operating Temperature: -40 to 85 degC; ComponentLink2URL: http://www.abracon.com/Resonators/ABS07.pdf; PackageReference: ABS07-2; ComponentLink3Description: Package Specification; ComponentLink1Description: Manufacturer URL; DatasheetVersion: 04.03.13; Mounting Technology: Surface Mount; ComponentLink2Description: Datasheet; ComponentLink1URL: http://www.abracon.com/; PartNumber: ABS07-32.768KHz-T; Packing: Tape and Reel; Frequency: 32.768 kHz

## Sheet Memory.SchDoc: Memory
size 431 x 279 mm; Author: Changran Liu / Kaiwen Zhou; CompanyName: Upenn; DrawnBy: Changran Liu / Kaiwen Zhou; Engineer: Changran Liu / Kaiwen Zhou; Organization: Upenn; DocumentNumber: 2; SheetNumber: 2; SheetTotal: 9
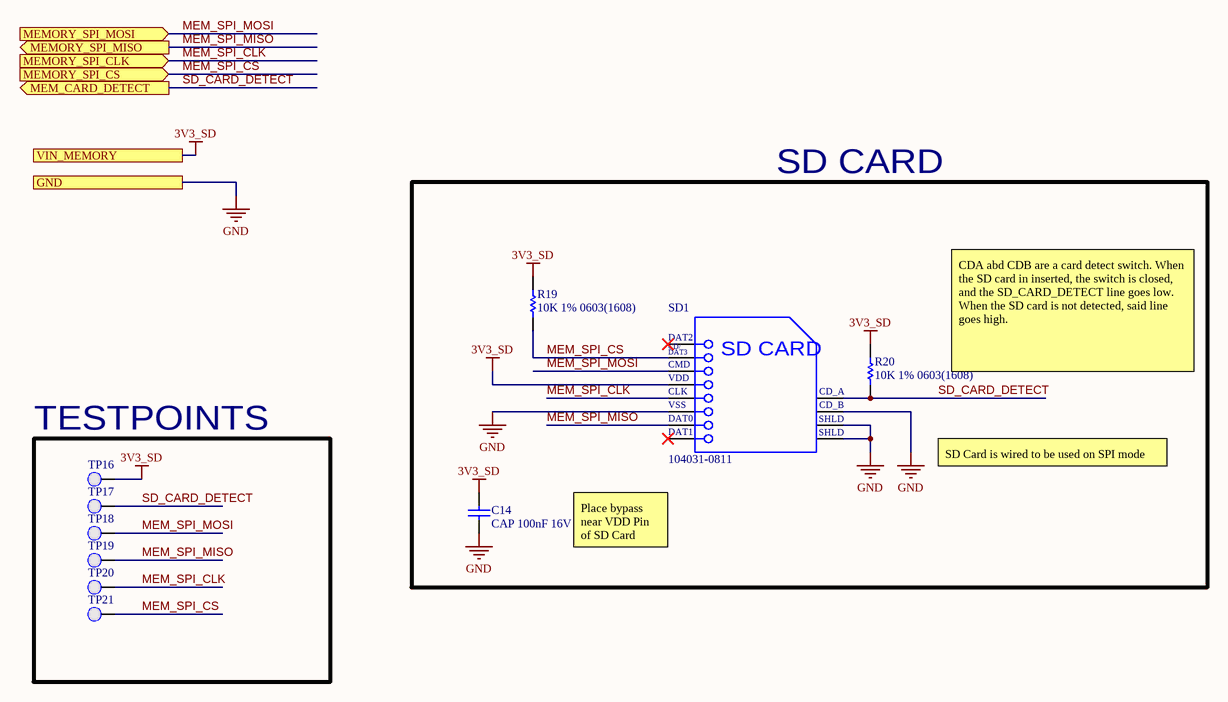
[diagram p3: Memory.SchDoc]

### Parts
C14  CAP 100nF 16V 0603(1608)  [CAPC0603(1608)100_N]
R19  10K 1% 0603(1608)  [RESC0603(1608)_N]
R20  10K 1% 0603(1608)  [RESC0603(1608)_N]
SD1  104031-0811  [MOLX-104031-0811_V]
TP16  0.1" Pad  [PCBComponent]  (value not drawn)
TP17  0.1" Pad  [PCBComponent]  (value not drawn)
TP18  0.1" Pad  [PCBComponent]  (value not drawn)
TP19  0.1" Pad  [PCBComponent]  (value not drawn)
TP20  0.1" Pad  [PCBComponent]  (value not drawn)
TP21  0.1" Pad  [PCBComponent]  (value not drawn)

### Blocks framed on the sheet
SD CARD: C14 R19 R20 SD1
TESTPOINTS: TP16-TP21

### Ports
GND, MEM_CARD_DETECT (out), MEMORY_SPI_CLK (in), MEMORY_SPI_CS (in), MEMORY_SPI_MISO (out), MEMORY_SPI_MOSI (in), VIN_MEMORY

### Nets
3V3_SD: C14.2 R19.2 R20.2 SD1.4(VDD) TP16.1(PAD) ; port VIN_MEMORY  [project net 3V3]
GND: C14.1 SD1.6(VSS2) SD1.10(CD_B) SD1.11(SHLD1) SD1.12(SHLD2) ; port GND
MEM_SPI_CLK: SD1.5(CLK) TP20.1(PAD) ; port MEMORY_SPI_CLK
MEM_SPI_CS: R19.1 SD1.2(CMD) TP21.1(PAD) ; port MEMORY_SPI_CS  [project net FLASH_MEM_SPI_SS]
MEM_SPI_MISO: SD1.7(DAT0) TP19.1(PAD) ; port MEMORY_SPI_MISO
MEM_SPI_MOSI: SD1.3(VSS1) TP18.1(PAD) ; port MEMORY_SPI_MOSI
SD_CARD_DETECT: R20.1 SD1.9(CD_A) TP17.1(PAD) ; port MEM_CARD_DETECT

Not connected (* = marked no-connect by the designer): SD1 1(CD/DAT3)* 8(DAT1)*

### Notes on the sheet
- CDA abd CDB are a card detect switch. When the SD card in inserted, the switch is closed, and the SD_CARD_DETECT line goes low. When the SD card is not detected, said line goes high.
- SD Card is wired to be used on SPI mode
- Place bypass near VDD Pin of SD Card
- DWG. NO.
- REV.
- SHT.
- THIS DOCUMENT AND THE DATA DISCLOSED HEREIN OR HEREWITH IS THE PROPERTY OF ALTIUM LIMITED AND MAY BE FREELY DISTRIBUTED IN WHOLE. NO RIGHTS ARE RESERVED OR EXPRESS OR IMPLIED WARANTEE GIVEN.
- REVISION
- DESCRIPTION
- DATE
- APPROVED
- ENG:
- APPROVALS
- PROJECT
- DSN:
- CHK:
- REFERENCE DOCUMENTS
- PROJECT REVISION:
- TITLE
- DOCUMENT REVISION:
- DESIGN ITEM:
- BOM:
- FAB DWG:
- PCB DWG:
- ASSY DWG:
- SCALE:
- SIZE
- B
- CAGE CODE
- FILE NAME
- DWG NO.
- SHEET
- OF
- REV
- (in symbol CMP-2000-05825-1) DAT2; CD/; DAT3; SD CARD; VSS; SHLD

### Library data of the parts
C14 = CMP-1035-02584-1: as C1 on sheet FTDI; Technology: SMT; Max Thickness: 1 mm; Value: 100nF; Rated Voltage: 16 V
R19 R20 = CMP-1012-00623-1: as R8 on sheet MAIN; Power: 0.1 W; Tolerance: 1 %; Technology: SMT
SD1 = CMP-2000-05825-1: Micro SD Card, RA, -25 to 85 degC, 8-Pin SMD, RoHS, Tape and Reel; Voltage Rating: 10VAC/DC; Number of Contacts: 8; Insertion - Extraction Style: Push-Pull; Pitch: 1.1mm; Mating Cycles: 10000; Brand: Molex; Current Rating: 500mA; Manufacturer URL: http://www.molex.com/; Card Type: microSD; Mounting Type: Standard; Height: 1.42mm; Mounting Technology: SurfaceMount; Contact Plating: Gold; Product Category: MemoryCardConnectors; Package Description: 8-Pin Surface Mount Device, Body 11.95 x 11.4 mm, Pitch 1.1 mm; Datasheet URL: http://www.molex.com/pdm_docs/sd/1040310811_sd.pdf; Termination Style: SMD; Length: 11.4mm; Housing Material: LiquidCrystalPolymer(LCP); Orientation: RightAngle; RoHS: True; Contact Material: PhosphorBronze; Datasheet Version: Rev. E, 04/2006; Packaging: Reel; Manufacturer: Molex; Series: 104031; Product: CardConnectors; Number of Rows: 1Row; Package Reference: 104031-0811
TP16-TP21 = 0.1" Pad-A.4

## Sheet 3.3V_BuckDesign.SchDoc: Buck
size 431 x 279 mm; Author: Changran Liu / Kaiwen Zhou; CompanyName: Upenn; DrawnBy: Changran Liu / Kaiwen Zhou; Engineer: Changran Liu / Kaiwen Zhou; Organization: Upenn; DocumentNumber: 6; SheetNumber: 5; SheetTotal: 9
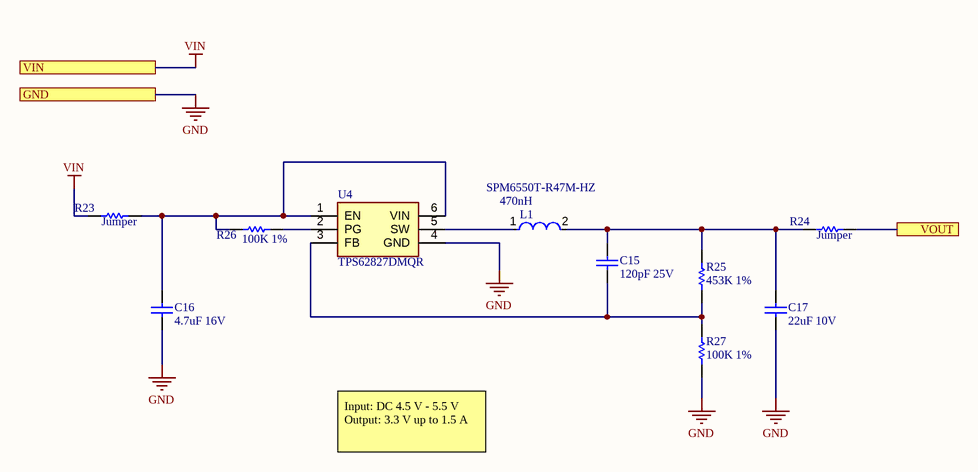
[diagram p4: 3.3V_BuckDesign.SchDoc]

### Parts
C15  120pF 25V  [CAPC0603(1608)100_N]
C16  4.7uF 16V  [CAPC0805(2012)145_N]
C17  22uF 10V  [CAPC0805(2012)100_L]
L1  SPM6550T-R47M-HZ  Inductance: 470nH  [FP-SPM6550-MFG]
R23  Jumper  [RESC0603(1608)_N]
R24  Jumper  [RESC0603(1608)_N]
R25  453K 1%  [RESC0402(1005)_L]
R26  100K 1%  [RESC0603(1608)_N]
R27  100K 1%  [RESC0603(1608)_N]
U4  TPS62827DMQR  [TPS6282518DMQR]

### Ports
GND, VIN, VOUT

### Nets
GND: C16.1 C17.1 R27.1 U4.4(GND) ; port GND
VIN: R23.1 ; port VIN
VOUT: R24.2 ; port VOUT
NetC15_1: C15.1 R25.1 R27.2 U4.3(FB)
NetC15_2: C15.2 C17.2 L1.2 R24.1 R25.2
NetC16_2: C16.2 R23.2 R26.1 U4.1(EN) U4.6(VIN)
NetL1_1: L1.1 U4.5(SW)
NetR26_2: R26.2 U4.2(PG)

### Notes on the sheet
- Input: DC 4.5 V - 5.5 V Output: 3.3 V up to 1.5 A
- DWG. NO.
- REV.
- SHT.
- THIS DOCUMENT AND THE DATA DISCLOSED HEREIN OR HEREWITH IS THE PROPERTY OF ALTIUM LIMITED AND MAY BE FREELY DISTRIBUTED IN WHOLE. NO RIGHTS ARE RESERVED OR EXPRESS OR IMPLIED WARANTEE GIVEN.
- REVISION
- DESCRIPTION
- DATE
- APPROVED
- ENG:
- APPROVALS
- PROJECT
- DSN:
- CHK:
- REFERENCE DOCUMENTS
- PROJECT REVISION:
- TITLE
- DOCUMENT REVISION:
- DESIGN ITEM:
- BOM:
- FAB DWG:
- PCB DWG:
- ASSY DWG:
- SCALE:
- SIZE
- B
- CAGE CODE
- FILE NAME
- DWG NO.
- SHEET
- OF
- REV

### Library data of the parts
C15 = CMP-1035-01312-1: CAP 120pF 25V ±1% 0603 (1608 Metric) Thickness 1mm SMD; Case-Metric: 1608; Case-EIA: 0603; Tolerance: Â±1%; Value: 120pF; Technology: SMT; Max Thickness: 1 mm; Rated Voltage: 25 V
C16 = CMP-1036-04893-1: as C4 on sheet FTDI; Max Thickness: 1.45 mm; Value: 4.7uF; Rated Voltage: 16 V; Tolerance: -20% to +80%; Technology: SMT
C17 = CMP-1036-04944-1: CAP 22uF 10V ±20% 0805 (2012 Metric) Thickness 1mm SMD; Case-Metric: 2012; Case-EIA: 0805; Tolerance: Â±20%; Technology: SMT; Max Thickness: 1 mm; Value: 22uF; Rated Voltage: 10 V
L1 = CMP-08253-000017-1: FIX IND 470NH 26.1A 2.97MOHM SMD; Manufacturer: TDK; Core Material: Metal; Shielding: true; Series Resistance: 2.97mΩ; Test Frequency: 100kHz; Rms Current: 20.5A; Automotive Grade: Grade 1; Tolerance: 20%; Standoff Height: 0.15mm; Lead Free: Yes; Manufacturer Part Number: SPM6550T-R47M-HZ; Automotive: Yes; ComponentLink2URL: https://product.tdk.com/info/en/catalog/datasheets/inductor_automotive_power_spm6550-hz_en.pdf; Temperature Range High: +125°C; Category: Ind; Height: 5mm; Device Class L2: Inductors; Device Class L3: Fixed Inductors; Temperature Range Low: -40°C; RoHS: TRUE; Temperature: -40°C to +125°C; ComponentLink2Description: Datasheet; Device Class L1: Passive Components; Package: SPM6550; Saturation Current: 20.5A; Digikey Description: FIX IND 470NH 26.1A 2.97MOHM SMD; Composition: Wirewound; Octopart: https://octopart.com/spm6550t-r47m-hz-tdk-90326484; Value: 470nH
R23 R24 = CMP-1012-00001-1: as R6 on sheet MAIN; Technology: SMT; Tolerance: None
R25 = CMP-1011-00810-1: 453K 0.063W 1% 0402 (1005 Metric)  SMD; Value: 453000.00 Ohm; Case-Metric: 1005; Case-EIA: 0402; Tolerance: 1 %; Power: 0.063 W; Technology: SMT
R26 R27 = CMP-1012-00736-1: 100K 0.1W 1% 0603 (1608 Metric)  SMD; Value: 100000.00 Ohm; Case-Metric: 1608; Case-EIA: 0603; Power: 0.1 W; Tolerance: 1 %; Technology: SMT
U4 = TPS62827DMQR: 2.4V-5.5V input, 4A step-down converter with 1% Accuracy in 1.5mm x 1.5mm QFN 6-VSON-HR -40 to 125; Manufacturer_Name: Texas Instruments; Datasheet Link: http://www.ti.com/lit/ds/symlink/tps62827.pdf; Height: 1mm; Manufacturer_Part_Number: TPS62827DMQR; Mouser Part Number: 595-TPS62827DMQR; Mouser Price/Stock: https://www.mouser.co.uk/ProductDetail/Texas-Instruments/TPS62827DMQR?qs=byeeYqUIh0P9BITyOJrN9g%3D%3D; Arrow Part Number: TPS62827DMQR; Arrow Price/Stock: https://www.arrow.com/en/products/tps62827dmqr/texas-instruments

## Sheet Audio.SchDoc: Audio
size 431 x 279 mm; Author: Changran Liu / Kaiwen Zhou; CompanyName: Upenn; DrawnBy: Changran Liu / Kaiwen Zhou; Engineer: Changran Liu / Kaiwen Zhou; Organization: Upenn; DocumentNumber: 7; SheetNumber: 6; SheetTotal: 9
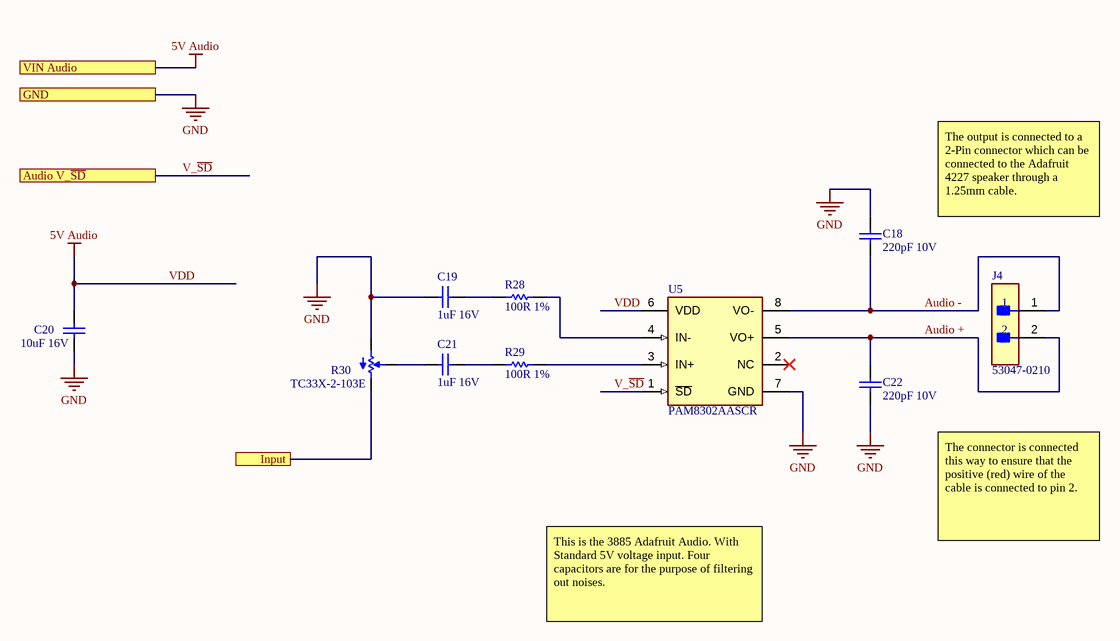
[diagram p5: Audio.SchDoc]

### Parts
C18  220pF 10V  [CAPC0603(1608)100_N]
C19  1uF 16V  [CAPC0603(1608)100_N]
C20  10uF 16V  [CAPC0805(2012)145_L]
C21  1uF 16V  [CAPC0603(1608)100_N]
C22  220pF 10V  [CAPC0603(1608)100_N]
J4  53047-0210  [FP-53047-0210-MFG]
R28  100R 1%  [RESC0603(1608)_M]
R29  100R 1%  [RESC0603(1608)_M]
R30  TC33X-2-103E  [BOUR-TC33X-2_V]
U5  PAM8302AASCR  [FP-MSOP-8-MFG]

### Ports
Audio V_~{SD}, GND, Input, VIN Audio

### Nets
5V Audio: C20.2 U5.6(VDD) ; port VIN Audio  [also labelled VDD]  [project net 5V]
GND: C18.1 C19.2 C20.1 C22.1 R30.3 U5.7(GND) ; port GND
Audio +: C22.2 J4.2 U5.5(VO+)  [project net Audio +_6]
Audio -: C18.2 J4.1 U5.8(VO-)  [project net Audio -_6]
SPEAKER_OUT: R30.1 ; port Input
V_~{SD}: U5.1(~{SD}) ; port Audio V_~{SD}  [project net Audio V_~{SD}]
NetC19_1: C19.1 R28.1
NetC21_1: C21.1 R29.1
NetC21_2: C21.2 R30.2
NetR28_2: R28.2 U5.4(IN-)
NetR29_2: R29.2 U5.3(IN+)

Not connected (* = marked no-connect by the designer): U5 2(NC)*

### Notes on the sheet
- The output is connected to a 2-Pin connector which can be connected to the Adafruit 4227 speaker through a 1.25mm cable.
- The connector is connected this way to ensure that the positive (red) wire of the cable is connected to pin 2.
- This is the 3885 Adafruit Audio. With Standard 5V voltage input. Four capacitors are for the purpose of filtering out noises.
- DWG. NO.
- REV.
- SHT.
- THIS DOCUMENT AND THE DATA DISCLOSED HEREIN OR HEREWITH IS THE PROPERTY OF ALTIUM LIMITED AND MAY BE FREELY DISTRIBUTED IN WHOLE. NO RIGHTS ARE RESERVED OR EXPRESS OR IMPLIED WARANTEE GIVEN.
- REVISION
- DESCRIPTION
- DATE
- APPROVED
- ENG:
- APPROVALS
- PROJECT
- DSN:
- CHK:
- REFERENCE DOCUMENTS
- PROJECT REVISION:
- TITLE
- DOCUMENT REVISION:
- DESIGN ITEM:
- BOM:
- FAB DWG:
- PCB DWG:
- ASSY DWG:
- SCALE:
- SIZE
- B
- CAGE CODE
- FILE NAME
- DWG NO.
- SHEET
- OF
- REV

### Library data of the parts
C18 C22 = CMP-1035-01455-1: CAP 220pF 10V ±2% 0603 (1608 Metric) Thickness 1mm SMD; Tolerance: Â±2%; Case-EIA: 0603; Case-Metric: 1608; Max Thickness: 1 mm; Technology: SMT; Value: 220pF; Rated Voltage: 10 V
C19 C21 = CMP-1035-02736-1: as C8 on sheet MCU; Technology: SMT; Max Thickness: 1 mm; Rated Voltage: 16 V; Value: 1uF
C20 = CMP-1036-04927-1: as C9 on sheet MCU; Rated Voltage: 16 V; Technology: SMT; Value: 10uF; Max Thickness: 1.45 mm
J4 = CMP-2000-05628-3: CONN HEADER VERT 2POS 1.25MM; Manufacturer: Molex; Conn Gender: Male; Voltage Rating: 125V; Conn Orientation: Vertical; Number Of Contacts: 2; Current Rating: 1A; Contact Material: Tin; Temperature Range Low: -40°C; ComponentLink2URL: http://www.molex.com/webdocs/datasheets/pdf/en-us/0530470210_PCB_HEADERS.pdf; Mouser Description: 1.25mm Pitch PicoBlade™ Wire-to-Board Header, Vertical, with Friction Lock, 2 Circuits; Manufacturer Part Number: 53047-0210; Temperature Range High: +85°C; ComponentLink2Description: Datasheet; Automotive: No; RoHS: TRUE; Ambient Temperature Range High: +85°C; Octopart: https://octopart.com/53047-0210-molex-276772; Footprint Url: https://www.molex.com/pdm_docs/sd/530470210_sd.pdf; Lead Free: Yes; Pitch: 1.25mm; Temperature: -40°C to +85°C; Device Class L2: Headers and Wire Housings; Package: 0; Ambient Temperature Range Low: -40°C; Digikey Description: CONN HEADER VERT 2POS 1.25MM; Category: Conn; Device Class L3: unset; Number Of Rows: 1; Device Class L1: Connectors; Height: 4.4mm
R28 R29 = CMP-1012-00397-1: as R15 on sheet MCU; Technology: SMT; Tolerance: 1 %; Power: 0.1 W
R30 = CMP-2100-03695-1: Trimming Potentiometer, 10000 Ohm, -40 to 100 degC, 3-Pin SMD, RoHS, Tape and Reel; Manufacturer: Bourns; Tolerance: 25%; Max Power Dissipation: 100mW; Number of Turns: 1; Resistance: 10KOhm; Temperature Coefficient: 250ppm/degreesC; Voltage Rating (DC): 50V; Datasheet URL: http://www.bourns.com/docs/Product-Datasheets/TC33.pdf; Composition: Potentiometer; Package Description: 3-Pin Surface Mount Device, Body 3.8 x 3.6 mm; Weight: 29.4mg; Power Rating: 100mW; Termination: FootPrint; Manufacturer URL: http://www.bourns.com/; Width: 0.118inch; Height: 0.047inch; Military Standard: Not; Radiation Hardening: No; Colour: Silver; Case/Package: SMD/SMT; Depth: 3.8mm; Min Operating Temperature: -40degC; Lead Free: LeadFree; Datasheet Version: 42583.0; REACH SVHC: NoSVHC; Length: 3mm; RoHSCompliant: true; Contact Plating: Silver; Taper: Linear; Packaging: TapeandReel; Mount: SurfaceMount; Max Operating Temperature: 100degC; Package Reference: TC33X-2; Package Quantity: 2500
U5 = CMP-12733-000002-1: IC AMP CLASS D MONO 2.5W 8MSOP; Manufacturer: Diodes Inc.; Nominal Supply Current: 4mA; Number Of Channels: 1; Max Junction Temp: +125°C; Min Supply Voltage: 2V; Power At Speaker R: 2.5W @ 4Ω; Max Supply Voltage: 5.5V; Voltage Gain: 24dB; Standoff Height: 0.05mm; Manufacturer Part Number: PAM8302AASCR; ComponentLink2URL: https://www.diodes.com/assets/Datasheets/PAM8302A.pdf; Mouser Description: Audio Amplifiers 2.5W MONO FILTERLESS CLASS-D AUDIO AMP; ComponentLink2Description: Datasheet; Temperature: -40°C to +85°C; Automotive: No; Footprint Url: https://www.diodes.com/assets/Package-Files/MSOP-8.pdf; Device Class L1: Integrated Circuits (ICs); Temperature Range Low: -40°C; Temperature Range High: +85°C; Lead Free: Yes; Package: MSOP-8; Height: 1.1mm; Category: IC; Ipc Land Pattern Name: SOP65P490X110-8; Octopart: https://octopart.com/pam8302aascr-diodes+inc.-29030473; RoHS: TRUE; Device Class L3: Amplifiers - Audio; Device Class L2: Linear ICs; Digikey Description: IC AMP CLASS D MONO 2.5W 8MSOP

## Sheet Thumbstick.SchDoc: Thumbstick
size 431 x 279 mm; Author: Changran Liu / Kaiwen Zhou; CompanyName: Upenn; DrawnBy: Changran Liu / Kaiwen Zhou; Engineer: Changran Liu / Kaiwen Zhou; Organization: Upenn; DocumentNumber: 8; SheetNumber: 7; SheetTotal: 9
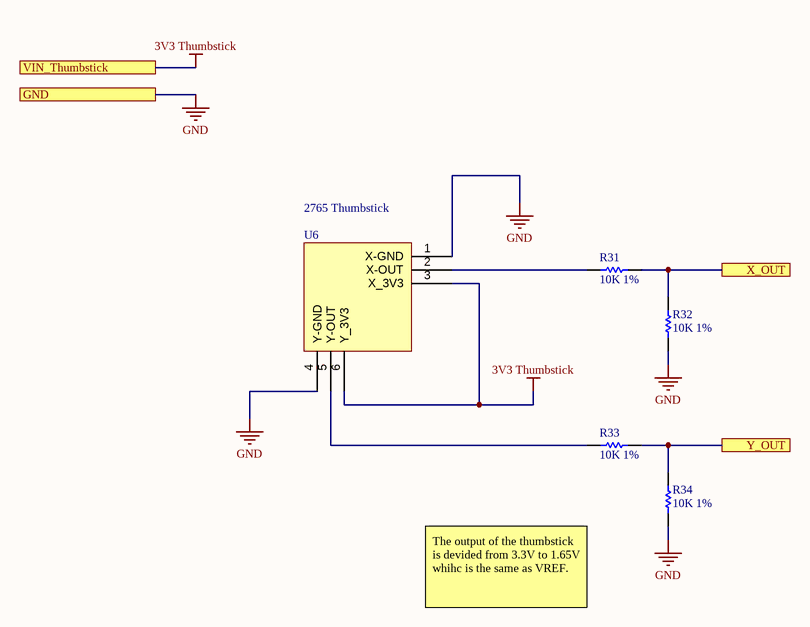
[diagram p6: Thumbstick.SchDoc]

### Parts
R31  10K 1%  [RESC0603(1608)_N]
R32  10K 1%  [RESC0603(1608)_N]
R33  10K 1%  [RESC0603(1608)_N]
R34  10K 1%  [RESC0603(1608)_N]
U6  2765 Thumbstick  [thumbstick]

### Ports
GND, VIN_Thumbstick, X_OUT, Y_OUT

### Nets
3V3 Thumbstick: U6.3(X_3V3) U6.6(Y_3V3) ; port VIN_Thumbstick  [project net 3V3]
GND: R32.1 R34.1 U6.1(X-GND) U6.4(Y-GND) ; port GND
JOYSTICK_X: R31.1 R32.2 ; port X_OUT
JOYSTICK_Y: R33.1 R34.2 ; port Y_OUT
NetR31_2: R31.2 U6.2(X-OUT)
NetR33_2: R33.2 U6.5(Y-OUT)

### Notes on the sheet
- The output of the thumbstick is devided from 3.3V to 1.65V whihc is the same as VREF.
- DWG. NO.
- REV.
- SHT.
- THIS DOCUMENT AND THE DATA DISCLOSED HEREIN OR HEREWITH IS THE PROPERTY OF ALTIUM LIMITED AND MAY BE FREELY DISTRIBUTED IN WHOLE. NO RIGHTS ARE RESERVED OR EXPRESS OR IMPLIED WARANTEE GIVEN.
- REVISION
- DESCRIPTION
- DATE
- APPROVED
- ENG:
- APPROVALS
- PROJECT
- DSN:
- CHK:
- REFERENCE DOCUMENTS
- PROJECT REVISION:
- TITLE
- DOCUMENT REVISION:
- DESIGN ITEM:
- BOM:
- FAB DWG:
- PCB DWG:
- ASSY DWG:
- SCALE:
- SIZE
- B
- CAGE CODE
- FILE NAME
- DWG NO.
- SHEET
- OF
- REV

### Library data of the parts
R31-R34 = CMP-1012-00623-1: as R8 on sheet MAIN; Power: 0.1 W; Tolerance: 1 %; Technology: SMT
U6 = 2765 Thumbstick: JOYSTICK 10K OHM 2 AXIS TH; Manufacturer: Adafruit Industries; Manufacturer Part Number: 2765; Resistance: 10kR; Supplier 1: Digi-Key; Supplier Part Number 1: 1528-1730-ND; RoHS: Yes; Stock 1: 17; Pricing 1: 1=2.50000 (USD); Mount: Through Hole; Packaging: Bulk; Length: 0.707inch; Width: 0.697inch; Height: 0.472inch; ComponentLink1URL: https://media.digikey.com/pdf/Data%20Sheets/Adafruit%20PDFs/2765_Web.pdf?src-supplier=Digi-Key; ComponentLink1Description: https://media.digikey.com/pdf/Data%20Sheets/Adafruit%20PDFs/2765_Web.pdf?src-supplier=Digi-Key